# Altium schematic sheet BANK16-17.SchDoc
size A4
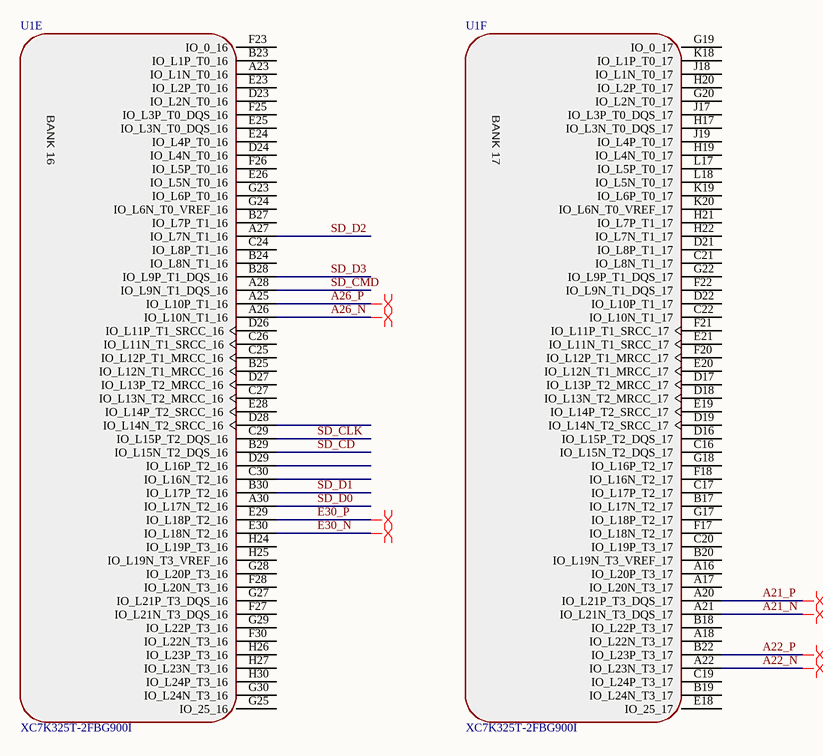
[diagram p0: BANK16-17.SchDoc]

## Parts
U1  XC7K325T-2FBG900I  [FBG900]  (parts E,F of 17)

## Nets
A21_N: U1.A21(IO_L21N_T3_DQS_17)
A21_P: U1.A20(IO_L21P_T3_DQS_17)
A22_N: U1.A22(IO_L23N_T3_17)
A22_P: U1.B22(IO_L23P_T3_17)
A26_N: U1.A26(IO_L10N_T1_16)
A26_P: U1.A25(IO_L10P_T1_16)
E30_N: U1.E30(IO_L18N_T2_16)
E30_P: U1.E29(IO_L18P_T2_16)
SD_CD: U1.B29(IO_L15N_T2_DQS_16)
SD_CLK: U1.C29(IO_L15P_T2_DQS_16)
SD_CMD: U1.A28(IO_L9N_T1_DQS_16)
SD_D0: U1.A30(IO_L17N_T2_16)
SD_D1: U1.B30(IO_L17P_T2_16)
SD_D2: U1.A27(IO_L7N_T1_16)
SD_D3: U1.B28(IO_L9P_T1_DQS_16)

Not connected (* = marked no-connect by the designer): U1 A16(IO_L20P_T3_17) A17(IO_L20N_T3_17) A18(IO_L22N_T3_17) A23(IO_L1N_T0_16) B17(IO_L17N_T2_17) B18(IO_L22P_T3_17) B19(IO_L24N_T3_17) B20(IO_L19N_T3_VREF_17) B23(IO_L1P_T0_16) B24(IO_L8N_T1_16) B25(IO_L12N_T1_MRCC_16) B27(IO_L7P_T1_16) C16(IO_L15N_T2_DQS_17) C17(IO_L17P_T2_17) C19(IO_L24P_T3_17) C20(IO_L19P_T3_17) C21(IO_L8N_T1_17) C22(IO_L10N_T1_17) C24(IO_L8P_T1_16) C25(IO_L12P_T1_MRCC_16) C26(IO_L11N_T1_SRCC_16) C27(IO_L13N_T2_MRCC_16) C30(IO_L16N_T2_16) D16(IO_L15P_T2_DQS_17) D17(IO_L13P_T2_MRCC_17) D18(IO_L13N_T2_MRCC_17) D19(IO_L14N_T2_SRCC_17) D21(IO_L8P_T1_17) D22(IO_L10P_T1_17) D23(IO_L2N_T0_16) D24(IO_L4N_T0_16) D26(IO_L11P_T1_SRCC_16) D27(IO_L13P_T2_MRCC_16) D28(IO_L14N_T2_SRCC_16) D29(IO_L16P_T2_16) E18(IO_25_17) E19(IO_L14P_T2_SRCC_17) E20(IO_L12N_T1_MRCC_17) E21(IO_L11N_T1_SRCC_17) E23(IO_L2P_T0_16) E24(IO_L4P_T0_16) E25(IO_L3N_T0_DQS_16) E26(IO_L5N_T0_16) E28(IO_L14P_T2_SRCC_16) F17(IO_L18N_T2_17) F18(IO_L16N_T2_17) F20(IO_L12P_T1_MRCC_17) F21(IO_L11P_T1_SRCC_17) F22(IO_L9N_T1_DQS_17) F23(IO_0_16) F25(IO_L3P_T0_DQS_16) F26(IO_L5P_T0_16) F27(IO_L21N_T3_DQS_16) F28(IO_L20N_T3_16) F30(IO_L22N_T3_16) G17(IO_L18P_T2_17) G18(IO_L16P_T2_17) G19(IO_0_17) G20(IO_L2N_T0_17) G22(IO_L9P_T1_DQS_17) G23(IO_L6P_T0_16) G24(IO_L6N_T0_VREF_16) G25(IO_25_16) G27(IO_L21P_T3_DQS_16) G28(IO_L20P_T3_16) G29(IO_L22P_T3_16) G30(IO_L24N_T3_16) H17(IO_L3N_T0_DQS_17) H19(IO_L4N_T0_17) H20(IO_L2P_T0_17) H21(IO_L7P_T1_17) H22(IO_L7N_T1_17) H24(IO_L19P_T3_16) H25(IO_L19N_T3_VREF_16) H26(IO_L23P_T3_16) H27(IO_L23N_T3_16) H30(IO_L24P_T3_16) J17(IO_L3P_T0_DQS_17) J18(IO_L1N_T0_17) J19(IO_L4P_T0_17) K18(IO_L1P_T0_17) K19(IO_L6P_T0_17) K20(IO_L6N_T0_VREF_17) L17(IO_L5P_T0_17) L18(IO_L5N_T0_17)

## Layout directives
differential pair: A21_N, A21_P, A22_N, A22_P, A26_N, A26_P, E30_N, E30_P

## Notes on the sheet
- (in symbol XC7K325T-2FBG900I, part E) BANK 16
- (in symbol XC7K325T-2FBG900I, part F) BANK 17